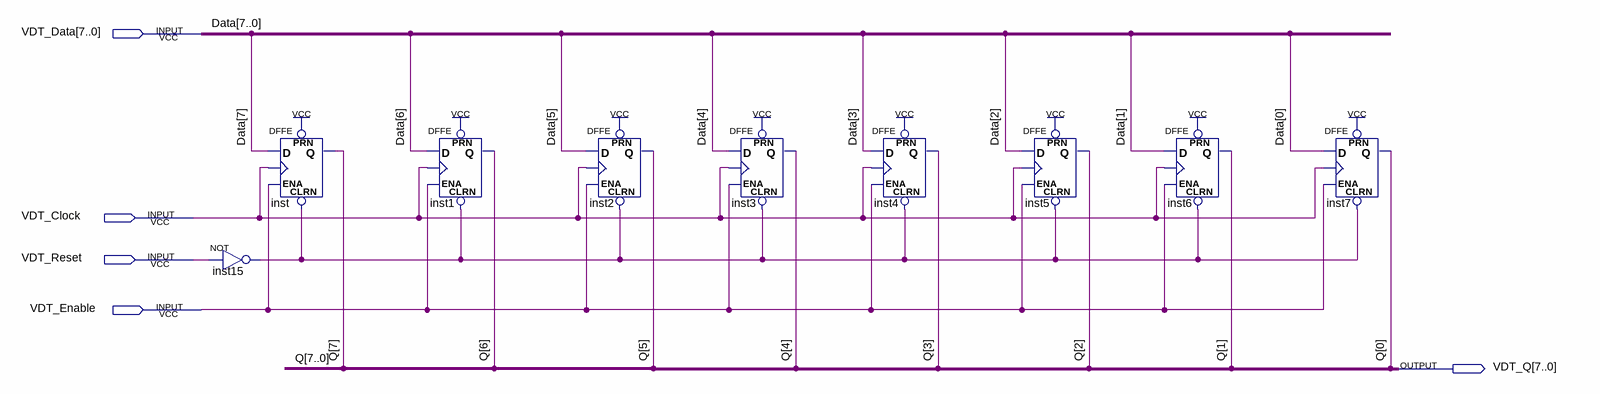
[diagram p0: schematic sheet]
// Quartus schematic assignment8.bdf as structural Verilog: 9 symbols, 5 pins
module assignment8 (
  input  [7:0] VDT_Data,
  input  VDT_Clock,
  input  VDT_Reset,
  input  VDT_Enable,
  output [7:0] VDT_Q
);

  wire inst15_out;

  not inst15 (inst15_out, VDT_Reset);
  DFFE inst (.PRN(1'b1), .CLRN(inst15_out), .D(VDT_Data[7]), .CLK(VDT_Clock), .ENA(VDT_Enable), .Q(VDT_Q[7]));
  DFFE inst1 (.PRN(1'b1), .CLRN(inst15_out), .D(VDT_Data[6]), .CLK(VDT_Clock), .ENA(VDT_Enable), .Q(VDT_Q[6]));
  DFFE inst2 (.PRN(1'b1), .CLRN(inst15_out), .D(VDT_Data[5]), .CLK(VDT_Clock), .ENA(VDT_Enable), .Q(VDT_Q[5]));
  DFFE inst3 (.PRN(1'b1), .CLRN(inst15_out), .D(VDT_Data[4]), .CLK(VDT_Clock), .ENA(VDT_Enable), .Q(VDT_Q[4]));
  DFFE inst4 (.PRN(1'b1), .CLRN(inst15_out), .D(VDT_Data[3]), .CLK(VDT_Clock), .ENA(VDT_Enable), .Q(VDT_Q[3]));
  DFFE inst5 (.PRN(1'b1), .CLRN(inst15_out), .D(VDT_Data[2]), .CLK(VDT_Clock), .ENA(VDT_Enable), .Q(VDT_Q[2]));
  DFFE inst6 (.PRN(1'b1), .CLRN(inst15_out), .D(VDT_Data[1]), .CLK(VDT_Clock), .ENA(VDT_Enable), .Q(VDT_Q[1]));
  DFFE inst7 (.PRN(1'b1), .CLRN(inst15_out), .D(VDT_Data[0]), .CLK(VDT_Clock), .ENA(VDT_Enable), .Q(VDT_Q[0]));

  // Other names for the same wires on the sheet: Data[7:0] = VDT_Data; Q[7:0] = VDT_Q
endmodule
